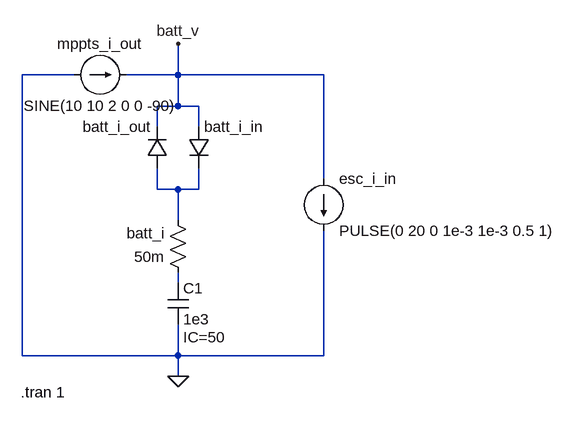
[diagram p0: schematic currents.asc]
currents.asc, the LTspice schematic file:
Version 4
SHEET 1 880 680
WIRE -16 -112 -96 -112
WIRE 144 -112 144 -160
WIRE 144 -112 64 -112
WIRE 368 -112 144 -112
WIRE 144 -64 144 -112
WIRE 144 -64 112 -64
WIRE 176 -64 144 -64
WIRE 112 -32 112 -64
WIRE 176 -32 176 -64
WIRE 368 48 368 -112
WIRE 112 64 112 32
WIRE 144 64 112 64
WIRE 176 64 176 32
WIRE 176 64 144 64
WIRE 144 112 144 64
WIRE 144 208 144 192
WIRE -96 320 -96 -112
WIRE 144 320 144 272
WIRE 144 320 -96 320
WIRE 368 320 368 128
WIRE 368 320 144 320
WIRE 144 352 144 320
FLAG 144 352 0
FLAG 144 -160 batt_v
SYMBOL current -16 -112 M90
WINDOW 0 -32 40 VBottom 2
WINDOW 3 32 40 VTop 2
WINDOW 123 0 0 Left 0
WINDOW 39 0 0 Left 0
SYMATTR InstName mppts_i_out
SYMATTR Value SINE(10 10 2 0 0 -90)
SYMBOL cap 128 208 R0
WINDOW 39 24 84 Left 2
SYMATTR InstName C1
SYMATTR Value 1e3
SYMATTR SpiceLine IC=50
SYMBOL res 160 208 R180
WINDOW 0 36 76 Left 2
WINDOW 3 36 40 Left 2
SYMATTR InstName batt_i
SYMATTR Value 50m
SYMBOL current 368 48 R0
WINDOW 123 0 0 Left 0
WINDOW 39 0 0 Left 0
SYMATTR InstName esc_i_in
SYMATTR Value PULSE(0 20 0 1e-3 1e-3 0.5 1)
SYMBOL diode 160 -32 R0
WINDOW 3 24 64 Invisible 2
SYMATTR InstName batt_i_in
SYMBOL diode 128 32 R180
WINDOW 0 24 64 Left 2
WINDOW 3 24 0 Invisible 2
SYMATTR InstName batt_i_out
TEXT -98 376 Left 2 !.tran 1

The netlist it stands for:
* currents.asc
I§mppts_i_out 0 batt_v SINE(10 10 2 0 0 -90)
C1 N002 0 1e3 IC=50
R§batt_i N002 N001 50m
I§esc_i_in batt_v 0 PULSE(0 20 0 1e-3 1e-3 0.5 1)
D§batt_i_in batt_v N001 D
D§batt_i_out N001 batt_v D
.model D D
.lib standard.dio
.tran 1
.backanno
.end